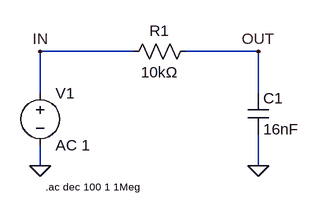
[diagram p0: schematic schematic.asc]
schematic.asc, the LTspice schematic file:
Version 4.1
SHEET 1 880 680
WIRE 256 -432 112 -432
WIRE 448 -432 336 -432
WIRE 112 -368 112 -432
WIRE 448 -368 448 -432
WIRE 112 -256 112 -288
WIRE 448 -256 448 -304
FLAG 112 -256 0
FLAG 448 -256 0
FLAG 112 -432 IN
FLAG 448 -432 OUT
SYMBOL voltage 112 -384 R0
SYMATTR InstName V1
SYMATTR Value AC 1
SYMBOL res 352 -448 R90
WINDOW 0 0 56 VBottom 2
WINDOW 3 32 56 VTop 2
SYMATTR InstName R1
SYMATTR Value 10kΩ
SYMBOL cap 432 -368 R0
SYMATTR InstName C1
SYMATTR Value 16nF
TEXT 120 -224 Left 1 !.ac dec 100 1 1Meg

The netlist it stands for:
* schematic.asc
V1 IN 0 AC 1
R1 OUT IN 10kΩ
C1 OUT 0 16nF
.ac dec 100 1 1Meg
.backanno
.end